# EAGLE design Adafruit SHT4x Trinkey (EAGLE 9.6.2)
AUTHOR: ladyada
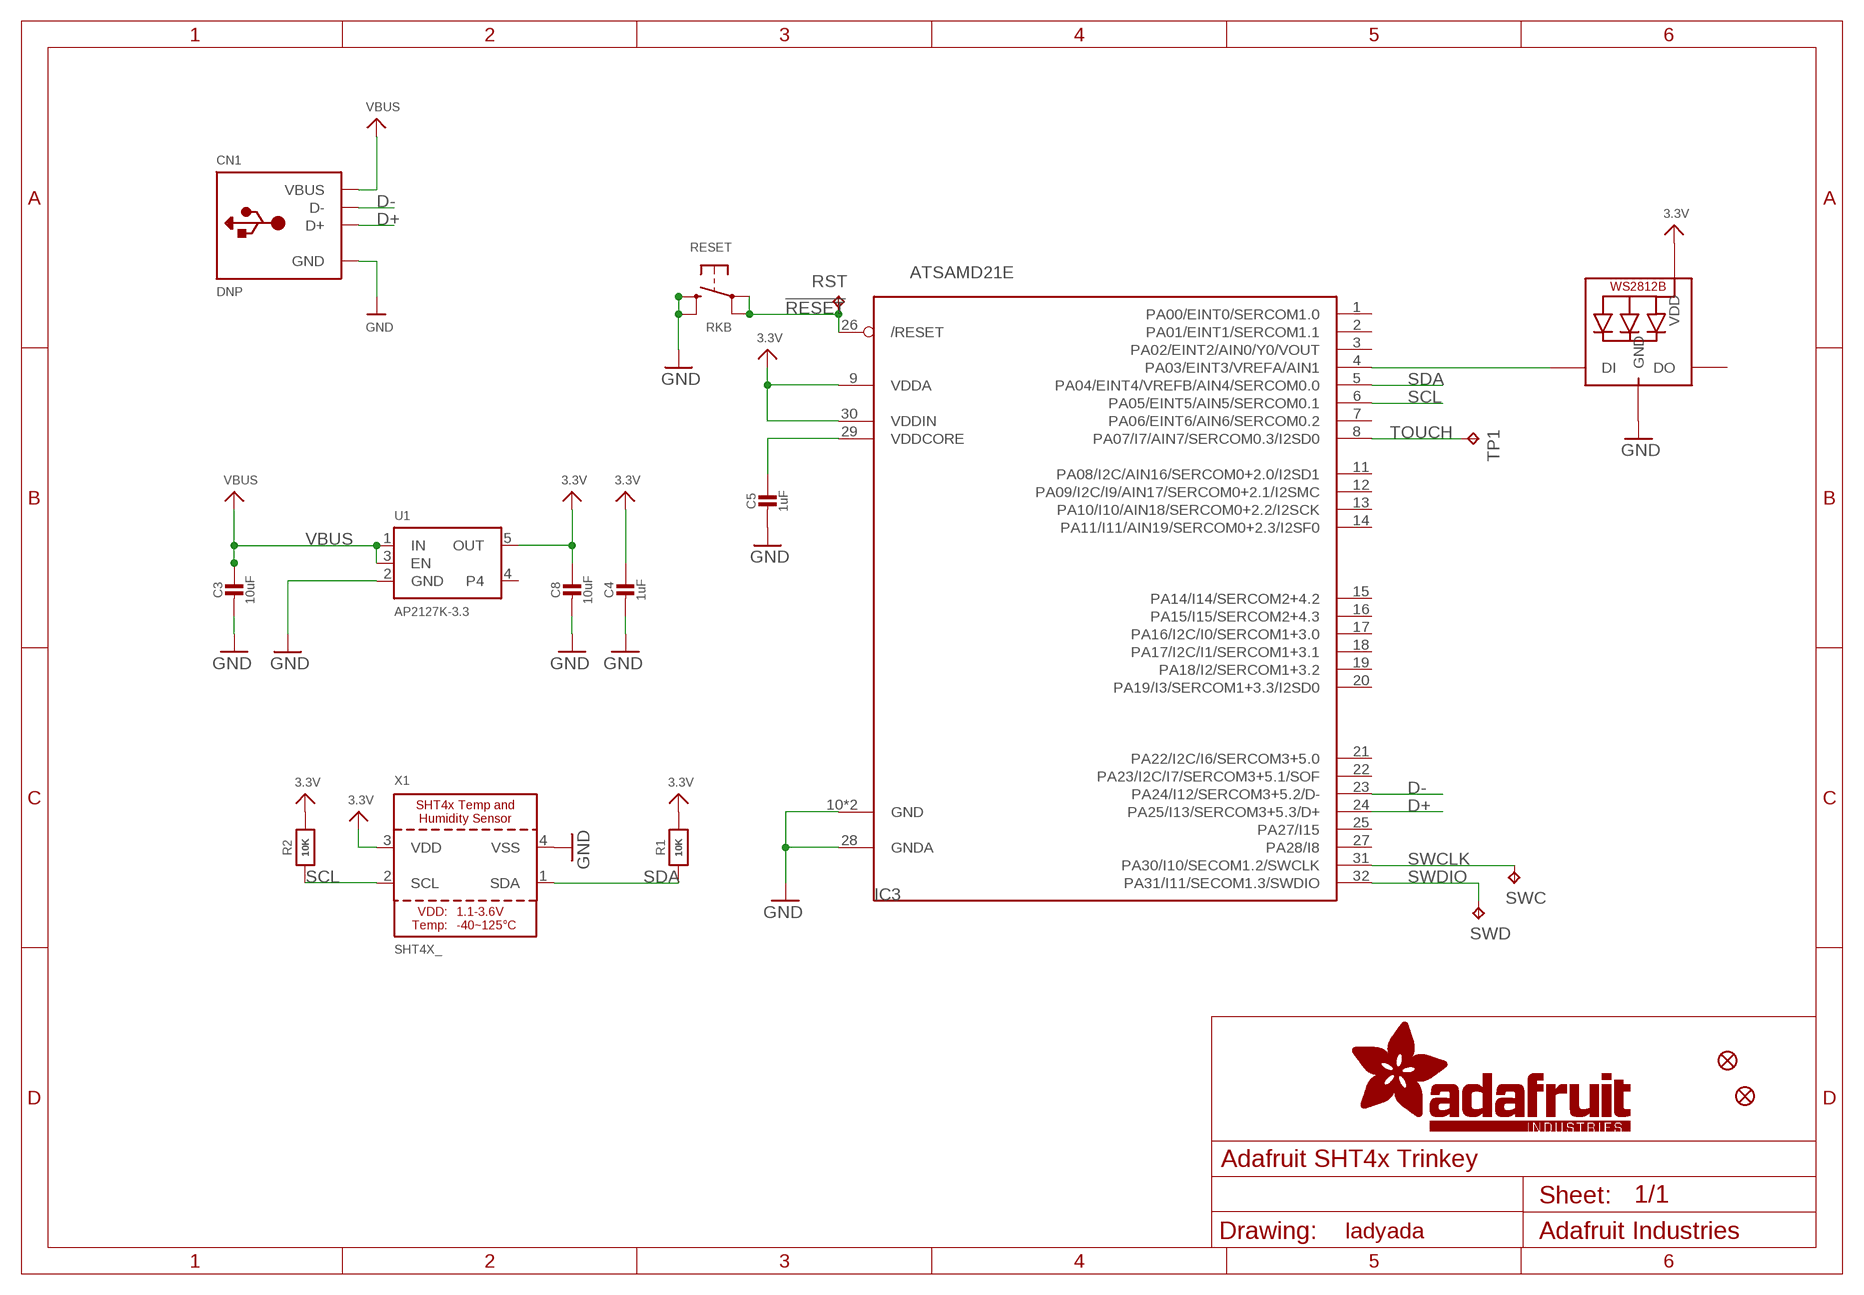
[diagram p0: schematic, sheet 1]

## Parts
C3  10uF  CAP_CERAMIC0805-NOOUTLINE  [0805-NO]
C4  1uF  CAP_CERAMIC_0603MP  [_0603MP]
C5  1uF  CAP_CERAMIC0603_NO  [0603-NO]
C8  10uF  CAP_CERAMIC0805-NOOUTLINE  [0805-NO]
CN1  DNP  USB_TYPEAPCB  [USBA_PCB]
FID1  FIDUCIAL_0.5MM  [FIDUCIAL_0.5MM]
FID2  FIDUCIAL_0.5MM  [FIDUCIAL_0.5MM]
IC3  ATSAMD21E  [QFN32_5MM]
LED1  WS2812B_SK6805_1515  [SK6805_1515]
R1  10K  RESISTOR_0402NO  [_0402NO]
R2  10K  RESISTOR_0402NO  [_0402NO]
RESET  RKB  SWITCH_TACT_SMT_RKB2  [BTN_RKB2_4.6X2.8]
RST  TPTP16R  [TP16R]
SWC  TPTP15R  [TP15R]
SWD  TPTP16R  [TP16R]
TP1  DNP  TPTP13R  [TP13R]
U1  AP2127K-3.3  VREG_SOT23-5  [SOT23-5]
X1  SHT4X_  [SHT4X]

## Nets
3.3V: C4.1 C8.1 IC3.9(VDDA) IC3.30(VDDIN) LED1.2(VDD) R1.2 R2.2 U1.5(OUT) X1.3(VDD)
!RESET: IC3.26(/RESET) RESET.A'(P1) RESET.A(P) RST.TP
D+: CN1.USB_PLUS(D+) IC3.24(PA25/I13/SERCOM3+5.3/D+)
D-: CN1.USB_NEG(D-) IC3.23(PA24/I12/SERCOM3+5.2/D-)
GND: C3.2 C4.2 C5.2 C8.2 CN1.GND IC3.10(GND) IC3.28(GNDA) IC3.33(GND) LED1.4(GND) RESET.B'(S1) RESET.B(S) U1.2(GND) X1.4(VSS)
N$1: IC3.4(PA03/EINT3/VREFA/AIN1) LED1.1(DI)
SCL: IC3.6(PA05/EINT5/AIN5/SERCOM0.1) R2.1 X1.2(SCL)
SDA: IC3.5(PA04/EINT4/VREFB/AIN4/SERCOM0.0) R1.1 X1.1(SDA)
SWCLK: IC3.31(PA30/I10/SECOM1.2/SWCLK) SWC.TP
SWDIO: IC3.32(PA31/I11/SECOM1.3/SWDIO) SWD.TP
TOUCH: IC3.8(PA07/I7/AIN7/SERCOM0.3/I2SD0) TP1.TP
VBUS: C3.1 CN1.VCC(VBUS) U1.1(IN) U1.3(EN)
VDDCORE1: C5.1 IC3.29(VDDCORE)
Unconnected: IC3.1(PA00/EINT0/SERCOM1.0) IC3.2(PA01/EINT1/SERCOM1.1) IC3.3(PA02/EINT2/AIN0/Y0/VOUT) IC3.7(PA06/EINT6/AIN6/SERCOM0.2) IC3.11(PA08/I2C/AIN16/SERCOM0+2.0/I2SD1) IC3.12(PA09/I2C/I9/AIN17/SERCOM0+2.1/I2SMC) IC3.13(PA10/I10/AIN18/SERCOM0+2.2/I2SCK) IC3.14(PA11/I11/AIN19/SERCOM0+2.3/I2SF0) IC3.15(PA14/I14/SERCOM2+4.2) IC3.16(PA15/I15/SERCOM2+4.3) IC3.17(PA16/I2C/I0/SERCOM1+3.0) IC3.18(PA17/I2C/I1/SERCOM1+3.1) IC3.19(PA18/I2/SERCOM1+3.2) IC3.20(PA19/I3/SERCOM1+3.3/I2SD0) IC3.21(PA22/I2C/I6/SERCOM3+5.0) IC3.22(PA23/I2C/I7/SERCOM3+5.1/SOF) IC3.25(PA27/I15) IC3.27(PA28/I8) LED1.3(DO) U1.4

## Library data of the parts
C3-C5 C8 = microbuilder:CAP_CERAMIC: Ceramic Capacitors For new designs, use the packages preceded by an '_' character since they are more reliable: The following footprints should be used on most boards: _0402 - Standard footprint for regular board layouts _0603 - Standard footprint for regular board layouts _0805 - Standard footprint for regular board layouts _1206 - Standard footprint for regular board layouts For extremely tight-pitch boards where space is at a premium, the following 'micro-pitch' footprints can be used (smaller pads, no silkscreen outline, etc.): _0402MP - Micro-pitch footprint for very dense/compact boards _0603MP - Micro-pitch footprint for very dense/compact boards _0805MP - Micro-pitch footprint for very dense/compact boards _1206MP - Micro-pitch footprint for very dense/compact boards
CN1 = adafruit_electromech:USB_TYPEA: USB - Type A Connectors Male types stick out and are inserted into a PC or matching females parts (these are the connectors used on USB Memory Sticks, etc.). Female parts are generally used for USB Host and accept a male-type connector. SMT - 4UCON: 10017 PTHFML - Digikey: 609-1045-ND, 4UCon: 05241 PCB - Use 2.0mm thick PCBs with this footprint
FID1 FID2 = microbuilder:FIDUCIAL: Fiducial Alignment Points Various fiducial points for machine vision alignment.
IC3 = adafruit_micro:ATSAMD21E
LED1 = microbuilder:WS2812B; LCSC: C2890035
R1 R2 = microbuilder:RESISTOR: Resistors For new designs, use the packages preceded by an '_' character since they are more reliable: The following footprints should be used on most boards: _0402 - Standard footprint for regular board layouts _0603 - Standard footprint for regular board layouts _0805 - Standard footprint for regular board layouts _1206 - Standard footprint for regular board layouts For extremely tight-pitch boards where space is at a premium, the following 'micro-pitch' footprints can be used (smaller pads, no silkscreen outline, etc.): _0402MP - Micro-pitch footprint for very dense/compact boards _0603MP - Micro-pitch footprint for very dense/compact boards _0805MP - Micro-pitch footprint for very dense/compact boards _1206MP - Micro-pitch footprint for very dense/compact boards
RESET = adafruit_electromech:SWITCH_TACT_SMT: SMT Tact Switches RKB2 https://www.digikey.com/short/m027prz5
RST SWC SWD TP1 = testpad:TP: Test pad
U1 = adafruit_power:VREG_SOT23-5: SOT23-5 Fixed Voltage Regulators Part Current Out V Out V In V Dropout θJA (°C/W) TJ (°C) Digikey Part No. ADP121 150mA 3.3V 3.4-5.5V 0.09V @ 150mA -- -- ADP121-AUJZ33R7CT-ND ADP121 150mA 3.0V 3.1-5.5V 0.09V @ 150mA -- -- ADP121-AUJZ30R7CT-ND ADP122 300mA 3.3V 3.4-5.5V 0.085V @ 300mA -- -- ADP122AUJZ-3.3-R7CT-ND ADP1712 300mA 3.3V 3.5-5.5V 0.17V @ 300mA -- -- ADP1712AUJZ-3.3-R7TR-ND AP7311 (Low Cost) 150mA 3.3V 3.5-6V 0.15V @ 150mA -- -- AP7311-33WG-7DICT-ND LD39015M18R 150mA 1.8V 1.9V-5.5V 0.08V @ 100mA -- -- 497-6977-1-ND LP2985A-33DBVR 150mA 3.3V 3.3-16V 0.28V @ 150mA 206 150 296-18479-1-ND MCP1824T-3302E/OT 300mA 3.3V 3.5V-6V 0.2V @ 300mA -- -- MCP1824T-3302E/OTCT-ND MIC5205-2.5YM5 TR 150mA 2.5V 2.7-16V 0.165V @ 150mA -- -- 576-1257-2-ND MIC5205-3.0YM5 TR 150mA 3.0V 3.2V-16V 0.165V @ 150mA -- -- 576-1258-2-ND MIC5205-3.3YM5 TR 150mA 3.3V 3.5V-16V 0.165V @ 150mA -- -- 576-1259-2-ND TPS780330220 150mA 3.3V+2.2V 3.6-5.5V 250mV Max -- -- 296-23332-1-ND TDA3663/N1,135 100mA 3.3V 3.5-45V 0.18V @ 50mA -- -- 568-5343-1-ND Max operating temp can be calculated using θJA, TJ (max junction temperature), and power in watts. Set the "Maximum Ambient Temperature" until it reaches TJ ("Max Junction Temperature"), which is the absolute limit for safe use of the regulator: Heat Sink Temperature Calculator <http://www.daycounter.com/Calculators/Heat-Sink-Temperature-Calculator.phtml> For example, With 12V source into a 3.3V LP2985 and a 30mA load, we are dissipating (12V-3.3V) * 0.03A = 0.261W. With a θJA of 206 °C/W, a TJ of 150°C, and 261mW we can safely use the chip without a heat sink up to 75°C (=147.1°C Junction Temperature).; JLC_ROTATION: 0
X1 = adafruit_sensor:SHT4X

## Board
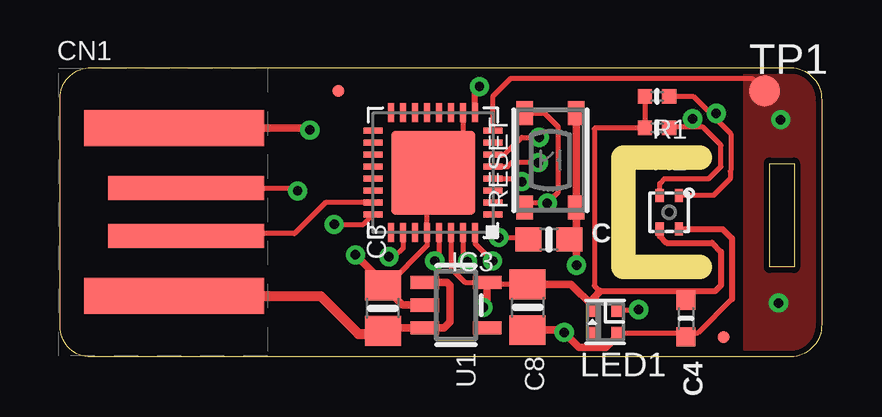
[diagram p1: board, top side]
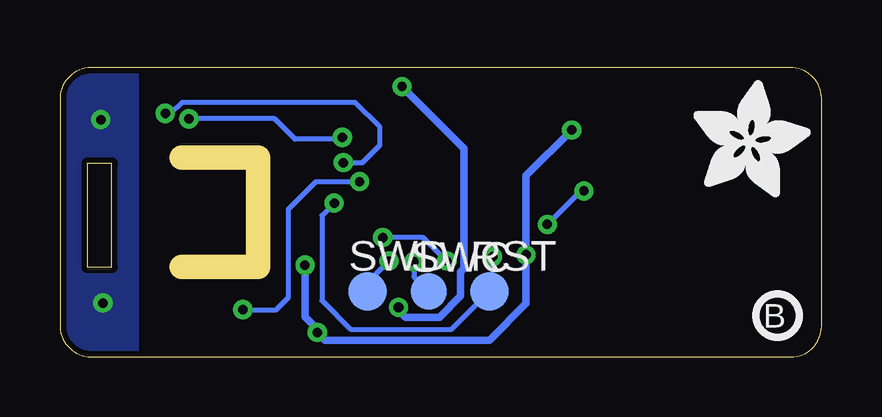
[diagram p2: board, bottom side, seen from below]

Size 31.75 x 12.06 mm. Coordinates in mm from the lower left corner, seen from the top.
Outline: 0,10.8 arc-90 1.3,12.06 30.48,12.06 arc-90 31.75,10.71 31.75,1.35 arc-90 30.48,0 1.27,0 arc-90 0,1.27 0,10.8
Outline: 29.59,8.06 30.61,8.06 30.61,3.75 29.59,3.75 29.59,8.06
Copper layers (1*16): Top 0.035mm / dielectric 1.5mm / Bottom 0.035mm
Design rules "adafruit 7-7": minimum track width 6mil, minimum drill 15.5mil, track to track 8mil, track to pad 7mil, pad to pad 7mil, via to via 7mil, smd to smd 7mil, copper to edge 10mil, drill to drill 8mil, minimum pad ring 10mil, minimum via ring 8mil, stop-mask expansion 2mil, vias tented up to drill 20mil, thermal gap 10mil
Milling: 3 lines

### Footprints (pad centres in the part's own frame; a part is rotated, then mirrored left to right if it is on the bottom)
0805-NO = smd 1.24 x 1.5: 1 -0.95,0; 2 0.95,0
_0603MP = smd 0.8 x 0.8: 1 -0.762,0; 2 0.762,0
0603-NO = smd 1.075 x 1: 1 -0.85,0; 2 0.85,0
USBA_PCB = smd 7.5 x 1.5: GND -0.2,3.5; VCC -0.2,-3.5 | smd 6.5 x 1: USB_NEG 0.3,-1; USB_PLUS 0.3,1
FIDUCIAL_0.5MM = smd 0.5 x 0.5: 1 0,0
QFN32_5MM = smd 0.8 x 0.25: 1 -2.5,1.75; 2 -2.5,1.25; 3 -2.5,0.75; 4 -2.5,0.25; 5 -2.5,-0.25; 6 -2.5,-0.75; 7 -2.5,-1.25; 8 -2.5,-1.75; 17 2.5,-1.75; 18 2.5,-1.25; 19 2.5,-0.75; 20 2.5,-0.25; 21 2.5,0.25; 22 2.5,0.75; 23 2.5,1.25; 24 2.5,1.75 | smd 0.25 x 0.8: 9 -1.75,-2.5; 10 -1.25,-2.5; 11 -0.75,-2.5; 12 -0.25,-2.5; 13 0.25,-2.5; 14 0.75,-2.5; 15 1.25,-2.5; 16 1.75,-2.5; 25 1.75,2.5; 26 1.25,2.5; 27 0.75,2.5; 28 0.25,2.5; 29 -0.25,2.5; 30 -0.75,2.5; 31 -1.25,2.5; 32 -1.75,2.5 | smd 3.5 x 3.5: 33 0,0
SK6805_1515 = smd 0.5 x 0.5: 1 -0.5,-0.45; 2 0.5,-0.45; 3 0.5,0.45; 4 -0.5,0.45
_0402NO = smd 0.6 x 0.6: 1 -0.508,0; 2 0.508,0
BTN_RKB2_4.6X2.8 = smd 1 x 0.7: A 1.973,1.075; A' -1.973,1.075; B 1.973,-1.075; B' -1.973,-1.075
TP16R = smd 1.6 x 1.6: TP 0,0
TP15R = smd 1.5 x 1.5: TP 0,0
TP13R = smd 1.3 x 1.3: TP 0,0
SOT23-5 = smd 0.55 x 1.2: 1 -0.95,-1.3; 2 0,-1.3; 3 0.95,-1.3; 4 0.95,1.3; 5 -0.95,1.3
SHT4X = smd 0.55 x 0.35: 1 -0.7,0.4; 2 -0.7,-0.4; 3 0.7,-0.4; 4 0.7,0.4

### Placement (x,y rotation side)
C3  13.46,2.03 90 top
C4  26.1,1.6 270 top
C5  20.38,4.9 0 top
C8  19.49,2.07 270 top
CN1  4.95,6.03 0 top
FID1  27.66,0.83 0 top
FID2  11.61,11.09 0 top
IC3  15.56,7.68 180 top
LED1  22.73,1.46 180 top
PLABEL4  [PLABEL4]  13.21,1.14 0 bottom
PLABEL5  [PLABEL5]  16.26,1.14 0 bottom
PLABEL6  [PLABEL6]  19.75,1.14 0 bottom
PLABEL7  [PLABEL7]  10.54,6.16 90 top
PLABEL8  [PLABEL8]  27.69,6.03 90 top
PLABEL9  [PLABEL9]  20.54,11.32 0 top
PLABEL10  [PLABEL10]  21.78,3.11 0 top
PLABEL11  [PLABEL11]  22.61,8.06 0 bottom
R1  24.89,10.87 180 top
R2  24.89,9.55 180 top
RESET  20.45,8.2 90 top
RST  13.84,2.73 0 bottom
SWC  16.38,2.73 0 bottom
SWD  18.92,2.73 0 bottom
TP1  29.38,11.09 0 top
U1  16.51,2.16 270 top
U$7  [ADAFRUIT_5MM]  5.33,6.67 0 bottom
U$8  [PCBFEAT-REV-040]  1.84,1.71 180 bottom
X1  25.4,6.03 270 top

### Tracks (layer width: path | path; a pad name or v marks a point on that pad's centre or on a via)
3.3V  (via drill 0.39, 0.4)
  Top 0.203: C8.1 17.9,3.02 U1.5 16.89,3.11 16.31,3.7 IC3.30 | R1.2 R2.2 22.31,9.55 22.28,9.52 22.28,2.97 22.52,2.73 | C4.1 26.1,2.67 26.16,2.73
  Top 0.254: IC3.9 17.31,11.09 v17.49,11.28 | X1.3 25,5.04 25.28,4.75 27.19,4.75 27.56,4.38 27.56,2.98 27.3,2.73 26.16,2.73 22.52,2.73
  Top 0.305: LED1.2 22.23,2.1 | 22.23,2.1 22.23,2.45 22.52,2.73 | C8.1 21.31,3.02 22.23,2.1 | U1.5 17.81,2.24 v17.64,2.07
  Bottom 0.305: v17.64,2.07 17.64,1.95 17.34,1.65 15.94,1.65 15.05,2.54 15.05,3.55 14.9,3.7 14.9,8.68 v17.49,11.28
!RESET  (via drill 0.39)
  Top 0.203: IC3.26 14.31,4.53 13.96,4.18 v13.72,4.18 | RESET.A' 19.55,6.41 v20.32,6.41 20.77,6.86 20.77,9.61 20.2,10.18 RESET.A
  Bottom 0.203: v20.32,6.41 20.83,5.91 20.83,2.35 19.63,1.16 15.42,1.16 RST.TP 13.72,2.86 v13.72,4.18
D+  (via drill 0.39)
  Top 0.203: CN1.USB_PLUS 9.79,7.03 v9.91,6.92 | v11.43,5.52 12.65,5.52 IC3.24
  Bottom 0.203: v9.91,6.92 10.03,6.92 v11.43,5.52
D-
  Top 0.203: IC3.23 11.07,6.43 9.78,5.14 5.36,5.14 CN1.USB_NEG
GND  (via drill 0.39)
  Top 0.203: C3.2 13.65,2.98 15.31,4.64 IC3.28 15.31,7.43 IC3.33 16.81,8.93 IC3.10 | 28.02,2.41 26.61,1.01 26.23,1.01 | LED1.4 23.37,1.01 26.23,1.01 | C4.2 26.1,0.88 26.23,1.01
  Top 0.254: X1.4 27.62,5.33 28.02,4.94 28.02,2.41
  Top 0.305: C5.2 21.52,5.19 RESET.B' 21.54,6.22 v21.54,3.82 21.52,3.84 RESET.B | U1.2 14.29,2.16 C3.2 13.46,3.11 v12.32,4.25 | CN1.GND 10.34,9.53 v10.41,9.46 | C8.2 20.91,1.12 v21.02,1.02 21.63,0.41 22.76,0.41 23.37,1.01
  Bottom 0.305: v10.41,9.46 12.32,7.56 v12.32,4.25 12.32,2.22 13.84,0.7 20.7,0.7 v21.02,1.02 21.02,1.15 21.54,1.66 v21.54,3.82
N$1  (via drill 0.39, 0.4)
  Top 0.203: IC3.4 19.14,7.43 v19.26,7.31 | LED1.1 23.29,1.97 v24.13,1.97
  Bottom 0.203: v19.26,7.31 21.07,7.31 22.23,6.16 22.23,2.48 22.73,1.97 v24.13,1.97
SCL  (via drill 0.39, 0.4)
  Top 0.203: IC3.6 18.53,8.43 19.25,9.16 v19.98,9.16 | X1.2 25,7.23 25.2,7.43 27.05,7.43 27.56,7.94 27.56,8.83 26.8,9.59 26.42,9.59 | R2.1 25.44,9.59 26.42,9.59 | v26.38,9.93 26.42,9.89 26.42,9.59
  Bottom 0.203: v19.98,9.16 19.98,9.08 21.95,9.08 22.8,9.93 v26.38,9.93
SDA  (via drill 0.39, 0.4)
  Top 0.203: IC3.5 18.66,7.93 18.83,8.1 v19.94,8.1 | R1.1 26.4,10.87 27.24,10.03 | X1.1 27.24,6.73 27.94,7.43 27.94,7.74 27.96,7.77 27.96,9.31 27.24,10.03 | v27.36,10.16 27.24,10.04 27.24,10.03
  Bottom 0.203: v19.94,8.1 19.14,8.1 18.41,8.83 18.41,9.59 19.44,10.61 26.66,10.61 27.11,10.16 v27.36,10.16
SWCLK  (via drill 0.39)
  Top 0.203: IC3.31 16.81,4.16 v16.99,3.97
  Bottom 0.203: v16.99,3.97 16.99,3.34 SWC.TP
SWDIO  (via drill 0.39)
  Top 0.203: IC3.32 17.31,4.73 v18.03,4
  Bottom 0.203: v18.03,4 18.92,3.11 SWD.TP
TOUCH  (via drill 0.39)
  Top 0.203: IC3.8 18.06,10.88 18.8,11.62 28.84,11.62 TP1.TP
  other vias: 29.96,2.25 30.05,9.89
  pour Bottom: 28.57,12.13 28.57,-0.06 31.88,-0.06 31.88,12.13
  pour Top (no thermals): 28.57,12.13 28.57,-0.06 31.88,-0.06 31.88,12.13
VBUS
  Top 0.305: C3.1 13.59,1.21 U1.3 16,1.21 16.26,1.46 16.26,2.98 16.13,3.11 U1.1
  Top 0.406: CN1.VCC 10.87,2.53 12.45,0.95 13.33,0.95 C3.1
VDDCORE1  (via drill 0.39)
  Top 0.203: IC3.29 15.81,4.18 v15.63,4 | v18.29,4.98 19.46,4.98 C5.1
  Bottom 0.203: v15.63,4 16.61,4.98 v18.29,4.98

### Text on the board
tValues: C1898
Pinguin_tBackup: Reset | Temp&Humid / Trinkey | SHT45 | NeoPixel | Trinkey | 2 | Neo | 1
Pinguin_bBackup: SHT45 Trinkey / SAMD21E18 / NeoPixel & Touch | NeoTrinkey / 4xNeoPixel / 2xTouch / ATSAMD21 / USB Key | Rst | SWC | SWD